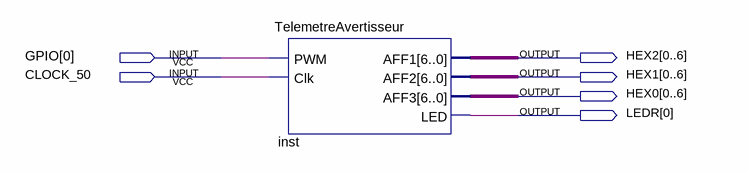
[diagram p0: schematic sheet]
// Quartus schematic SchematicTelemetre.bdf as structural Verilog: 1 symbols, 6 pins
module SchematicTelemetre (
  input  [0:0] GPIO,
  input  CLOCK_50,
  output [0:6] HEX2,
  output [0:6] HEX1,
  output [0:6] HEX0,
  output [0:0] LEDR
);

  TelemetreAvertisseur inst (.PWM(GPIO[0]), .Clk(CLOCK_50), .AFF1(HEX2), .AFF2(HEX1), .AFF3(HEX0), .LED(LEDR[0]));
endmodule
